# Altium project UCLA-DRS4-2.1.PrjPCB (part 2 of 10)

## Sheet ANA_FE.SchDoc: My title
size A3; Organization: University of California; Address1: 475 Portola Plaza; Address2: Los Angeles, CA 90095; DocumentNumber: 30; Revision: R01; SheetNumber: 30; SheetTotal: 35
Used 8 times, as channels DRS-Module 0/FE0, DRS-Module 0/FE2, DRS-Module 0/FE4, DRS-Module 0/FE6, DRS-Module 0/FE1, DRS-Module 0/FE3, DRS-Module 0/FE5, DRS-Module 0/FE7. Parts and nets are listed once, with the designators drawn on the sheet.
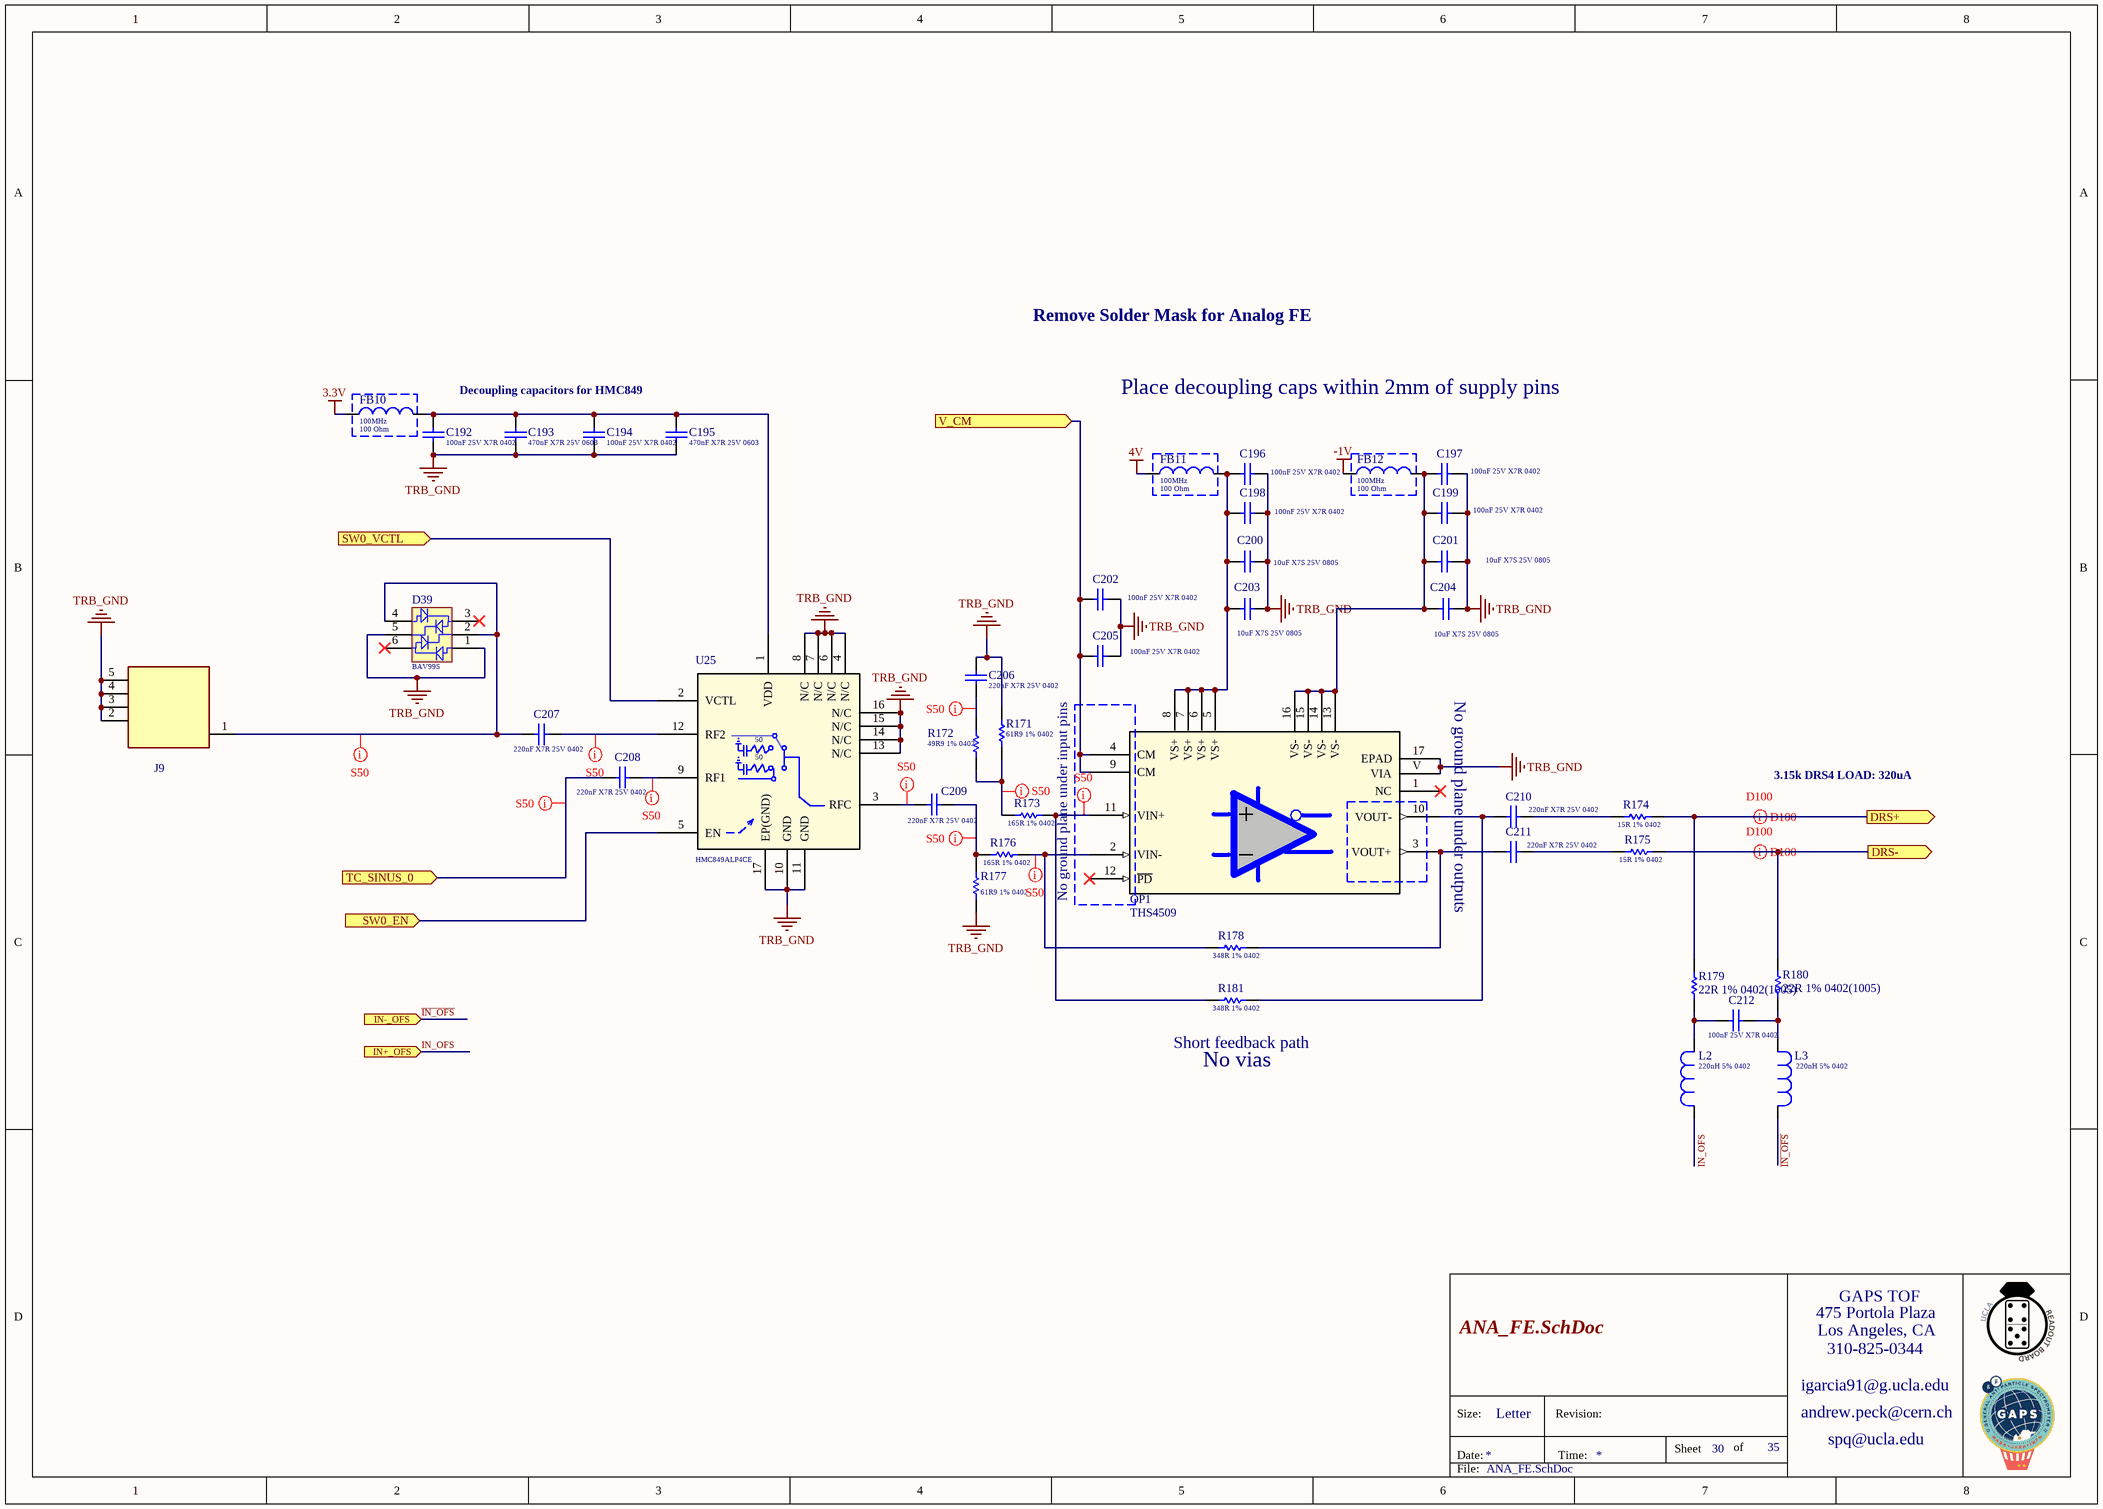
[diagram p3: ANA_FE.SchDoc]

### Parts
C192  Capacitance: 100nF 25V X7R 0402  [Cap_Taiyo_Yuden_TMK105B7104KV-FR_100nF]  (hidden comment: Cap_Taiyo_Yuden_TMK105B7104KV-FR_100nF)
C193  Capacitance: 470nF X7R 25V 0603  [Cap_Wurth_Electronics_885012206075_470nF]  (hidden comment: Cap_Wurth_Electronics_885012206075_470nF)
C194  Capacitance: 100nF 25V X7R 0402  [Cap_Taiyo_Yuden_TMK105B7104KV-FR_100nF]  (hidden comment: Cap_Taiyo_Yuden_TMK105B7104KV-FR_100nF)
C195  Capacitance: 470nF X7R 25V 0603  [Cap_Wurth_Electronics_885012206075_470nF]  (hidden comment: Cap_Wurth_Electronics_885012206075_470nF)
C196  Capacitance: 100nF 25V X7R 0402  [Cap_Taiyo_Yuden_TMK105B7104KV-FR_100nF]  (hidden comment: Cap_Taiyo_Yuden_TMK105B7104KV-FR_100nF)
C197  Capacitance: 100nF 25V X7R 0402  [Cap_Taiyo_Yuden_TMK105B7104KV-FR_100nF]  (hidden comment: Cap_Taiyo_Yuden_TMK105B7104KV-FR_100nF)
C198  Capacitance: 100nF 25V X7R 0402  [Cap_Taiyo_Yuden_TMK105B7104KV-FR_100nF]  (hidden comment: Cap_Taiyo_Yuden_TMK105B7104KV-FR_100nF)
C199  Capacitance: 100nF 25V X7R 0402  [Cap_Taiyo_Yuden_TMK105B7104KV-FR_100nF]  (hidden comment: Cap_Taiyo_Yuden_TMK105B7104KV-FR_100nF)
C200  Capacitance: 10uF X7S 25V 0805  [Cap_Murata_ GRM21BC71E106ME11L_10uF]  (hidden comment: Cap_Murata_ GRM21BC71E106ME11L_10uF)
C201  Capacitance: 10uF X7S 25V 0805  [Cap_Murata_ GRM21BC71E106ME11L_10uF]  (hidden comment: Cap_Murata_ GRM21BC71E106ME11L_10uF)
C202  Capacitance: 100nF 25V X7R 0402  [Cap_Taiyo_Yuden_TMK105B7104KV-FR_100nF]  (hidden comment: Cap_Taiyo_Yuden_TMK105B7104KV-FR_100nF)
C203  Capacitance: 10uF X7S 25V 0805  [Cap_Murata_ GRM21BC71E106ME11L_10uF]  (hidden comment: Cap_Murata_ GRM21BC71E106ME11L_10uF)
C204  Capacitance: 10uF X7S 25V 0805  [Cap_Murata_ GRM21BC71E106ME11L_10uF]  (hidden comment: Cap_Murata_ GRM21BC71E106ME11L_10uF)
C205  Capacitance: 100nF 25V X7R 0402  [Cap_Taiyo_Yuden_TMK105B7104KV-FR_100nF]  (hidden comment: Cap_Taiyo_Yuden_TMK105B7104KV-FR_100nF)
C206  Capacitance: 220nF X7R 25V 0402  [Cap_TDK_C1608X5R1A106M080AC_220nF]  (hidden comment: Cap_TDK_C1608X5R1A106M080AC_220nF)
C207  Capacitance: 220nF X7R 25V 0402  [Cap_TDK_C1608X5R1A106M080AC_220nF]  (hidden comment: Cap_TDK_C1608X5R1A106M080AC_220nF)
C208  Capacitance: 220nF X7R 25V 0402  [Cap_TDK_C1608X5R1A106M080AC_220nF]  (hidden comment: Cap_TDK_C1608X5R1A106M080AC_220nF)
C209  Capacitance: 220nF X7R 25V 0402  [Cap_TDK_C1608X5R1A106M080AC_220nF]  (hidden comment: Cap_TDK_C1608X5R1A106M080AC_220nF)
C210  Capacitance: 220nF X7R 25V 0402  [Cap_TDK_C1608X5R1A106M080AC_220nF]  (hidden comment: Cap_TDK_C1608X5R1A106M080AC_220nF)
C211  Capacitance: 220nF X7R 25V 0402  [Cap_TDK_C1608X5R1A106M080AC_220nF]  (hidden comment: Cap_TDK_C1608X5R1A106M080AC_220nF)
C212  Capacitance: 100nF 25V X7R 0402  [Cap_Taiyo_Yuden_TMK105B7104KV-FR_100nF]  (hidden comment: Cap_Taiyo_Yuden_TMK105B7104KV-FR_100nF)
D39  BAV99S  [INF-SOT363_V]
FB10  Measuring Frequency: 100MHz  Impedance: 100 Ohm  [FB_Wurth_Electronics_742792731_100Ohms]  (hidden comment: 742792731)
FB11  Measuring Frequency: 100MHz  Impedance: 100 Ohm  [FB_Wurth_Electronics_742792731_100Ohms]  (hidden comment: 742792731)
FB12  Measuring Frequency: 100MHz  Impedance: 100 Ohm  [FB_Wurth_Electronics_742792731_100Ohms]  (hidden comment: 742792731)
J9  SMA JACK 50 OHM  [Amphenol_132289_0]  (value not drawn)
L2  Inductance: 220nH 5% 0402  [Ind_TDK_ MLG1005SR22JT000_220nH]  (hidden comment: Ind_TDK_ MLG1005SR22JT000_220nH)
L3  Inductance: 220nH 5% 0402  [Ind_TDK_ MLG1005SR22JT000_220nH]  (hidden comment: Ind_TDK_ MLG1005SR22JT000_220nH)
OP1  THS4509  [RGT16]
R171  61R9 1% 0402  [RESC0402(1005)_L]
R172  49R9 1% 0402  [RESC0402(1005)_L]
R173  165R 1% 0402  [RESC0402(1005)_L]
R174  15R 1% 0402  [RESC0402(1005)_L]
R175  15R 1% 0402  [RESC0402(1005)_L]
R176  165R 1% 0402  [RESC0402(1005)_L]
R177  61R9 1% 0402  [RESC0402(1005)_L]
R178  348R 1% 0402  [RESC0402(1005)_L]
R179  22R 1% 0402(1005)  [RESC0402(1005)_N]
R180  22R 1% 0402(1005)  [RESC0402(1005)_N]
R181  348R 1% 0402  [RESC0402(1005)_L]
U25  HMC849  [CP_16_40]  (value not drawn)

### Ports
DRS+ (out), DRS- (out), IN+_OFS (in), IN-_OFS (in), SW0_EN (in), SW0_VCTL (in), TC_SINUS_0 (in), V_CM (in)

### Nets
3.3V: FB10.1
4V: FB11.1
-1V: FB12.1
TRB_GND: C192.1 C193.2 C194.1 C195.2 C196.2 C197.2 C198.2 C199.2 C200.1 C201.1 C202.2 C203.1 C204.1 C205.2 C206.1 D39.1(A1) D39.5(K5) J9.2(MNT_1) J9.3(MNT_2) J9.4(MNT_3) J9.5(MNT_4) OP1.17(EPAD) OP1.V(VIA) R171.2 R177.1 U25.4(N/C) U25.6(N/C) U25.7(N/C) U25.8(N/C) U25.10(GND) U25.11(GND) U25.13(N/C) U25.14(N/C) U25.15(N/C) U25.16(N/C) U25.17(EP(GND))
DRS+: R174.2 R179.2 ; port DRS+
DRS-: R175.2 R180.2 ; port DRS-
~{IN}~{_OFS}: L3.1 ; port IN-_OFS
IN_OFS: L2.2 ; port IN+_OFS
SW0_EN: U25.5(EN) ; port SW0_EN
SW0_VCTL: U25.2(VCTL) ; port SW0_VCTL
TC_SINUS_0: C208.2 ; port TC_SINUS_0
V_CM: C202.1 C205.1 OP1.4(CM) OP1.9(CM) ; port V_CM
NetC192_2: C192.2 C193.1 C194.2 C195.1 FB10.2 U25.1(VDD)
NetC196_1: C196.1 C198.1 C200.2 C203.2 FB11.2 OP1.5(VS+) OP1.6(VS+) OP1.7(VS+) OP1.8(VS+)
NetC197_1: C197.1 C199.1 C201.2 C204.2 FB12.2 OP1.13(VS-) OP1.14(VS-) OP1.15(VS-) OP1.16(VS-)
NetC206_2: C206.2 R172.2
NetC207_1: C207.1 U25.12(RF2)
NetC207_2: C207.2 D39.2(K2) D39.4(A4) J9.1
NetC208_1: C208.1 U25.9(RF1)
NetC209_1: C209.1 R176.1 R177.2
NetC209_2: C209.2 U25.3(RFC)
NetC210_1: C210.1 R174.1
NetC210_2: C210.2 OP1.10(VOUT-) R181.2
NetC211_1: C211.1 R175.1
NetC211_2: C211.2 OP1.3(VOUT+) R178.2
NetC212_1: C212.1 L2.1 R179.1
NetC212_2: C212.2 L3.2 R180.1
NetOP1_2: OP1.2(VIN-) R176.2 R178.1
NetOP1_11: OP1.11(VIN+) R173.2 R181.1
NetR171_1: R171.1 R172.1 R173.1

Not connected (* = marked no-connect by the designer): D39 3(C3)* 6(C6)*; OP1 1(NC)* 12(~{PD})*

### Channels
DRS-Module 0/FE0: designators end in A; ports DRS+=DRS4_IN0_P DRS-=DRS4_IN0_N IN+_OFS=IN+_OFS IN-_OFS=~{IN}~{_OFS} SW0_EN=HMC849:EN0 SW0_VCTL=HMC849:VCTL0 TC_SINUS_0=TC_0 V_CM=V_CM
DRS-Module 0/FE2: designators end in B; ports DRS+=DRS4_IN2_P DRS-=DRS4_IN2_N IN+_OFS=IN+_OFS IN-_OFS=~{IN}~{_OFS} SW0_EN=HMC849:EN2 SW0_VCTL=HMC849:VCTL2 TC_SINUS_0=TC_2 V_CM=V_CM
DRS-Module 0/FE4: designators end in C; ports DRS+=DRS4_IN4_P DRS-=DRS4_IN4_N IN+_OFS=IN+_OFS IN-_OFS=~{IN}~{_OFS} SW0_EN=HMC849:EN4 SW0_VCTL=HMC849:VCTL4 TC_SINUS_0=TC_4 V_CM=V_CM
DRS-Module 0/FE6: designators end in D; ports DRS+=DRS4_IN6_P DRS-=DRS4_IN6_N IN+_OFS=IN+_OFS IN-_OFS=~{IN}~{_OFS} SW0_EN=HMC849:EN6 SW0_VCTL=HMC849:VCTL6 TC_SINUS_0=TC_6 V_CM=V_CM
DRS-Module 0/FE1: designators end in E; ports DRS+=DRS4_IN1_P DRS-=DRS4_IN1_N IN+_OFS=IN+_OFS IN-_OFS=~{IN}~{_OFS} SW0_EN=HMC849:EN1 SW0_VCTL=HMC849:VCTL1 TC_SINUS_0=TC_1 V_CM=V_CM
DRS-Module 0/FE3: designators end in F; ports DRS+=DRS4_IN3_P DRS-=DRS4_IN3_N IN+_OFS=IN+_OFS IN-_OFS=~{IN}~{_OFS} SW0_EN=HMC849:EN3 SW0_VCTL=HMC849:VCTL3 TC_SINUS_0=TC_3 V_CM=V_CM
DRS-Module 0/FE5: designators end in G; ports DRS+=DRS4_IN5_P DRS-=DRS4_IN5_N IN+_OFS=IN+_OFS IN-_OFS=~{IN}~{_OFS} SW0_EN=HMC849:EN5 SW0_VCTL=HMC849:VCTL5 TC_SINUS_0=TC_5 V_CM=V_CM
DRS-Module 0/FE7: designators end in H; ports DRS+=DRS4_IN7_P DRS-=DRS4_IN7_N IN+_OFS=IN+_OFS IN-_OFS=~{IN}~{_OFS} SW0_EN=HMC849:EN7 SW0_VCTL=HMC849:VCTL7 TC_SINUS_0=TC_7 V_CM=V_CM

### Layout directives
net class S50: NetC206A_2, NetC207A_1, NetC207A_2, NetC208A_1, NetC209A_1, NetC209A_2, NetOP1A_2, NetOP1A_11, NetR171A_1, TC_0
differential pair; differential pair class D100: DRS4_IN0_N, DRS4_IN0_P

### Notes on the sheet
- Remove Solder Mask for Analog FE
- Decoupling capacitors for HMC849
- Place decoupling caps within 2mm of supply pins
- No ground plane under outputs
- 3.15k DRS4 LOAD: 320uA
- D100
- (near R173) No ground plane under input pins
- (near R181) Short feedback path
- (near R181) No vias
- 475 Portola Plaza
- GAPS TOF
- igarcia91@g.ucla.edu
- Los Angeles, CA
- 310-825-0344
- Size:
- Date:
- Letter
- Revision:
- Time:
- Sheet
- of
- andrew.peck@cern.ch
- spq@ucla.edu
- File:
- (in symbol HMC849ALP4CE) 50

### Library data of the parts
C192 C194 C196-C199 C202 C205 C212 = Cap_Taiyo_Yuden_TMK105B7104KV-FR_100nF: CAP CER 100nF 25V X7R 0402; Supplier 1: Mouser; Supplier Part Number 1: 963-TMK105B7104KV-FR
C193 C195 = Cap_Wurth_Electronics_885012206075_470nF: CAP CER 470nF 25V X7R 0603; Supplier 1: Mouser; Supplier Part Number 1: 710-885012206075
C200 C201 C203 C204 = Cap_Murata_ GRM21BC71E106ME11L_10uF: CAP CER 10uF 25V X7R 0805; Supplier 1: Mouser; Supplier Part Number 1: 81-GRM21BC71E106ME1L
C206-C211 = Cap_TDK_C1608X5R1A106M080AC_220nF: CAP CER 220nF 50V X7R 0402; Supplier 1: Mouser; Supplier Part Number 1: 810-C1005X7R1E224KBE
D39 = CMP-1176-00030-1: Silicon Switching Diode, SOT363, Reel, Green; Manufacturer: Infineon; VR (max): 80Â V; VBR (min): 85Â V; IF (max): 200Â mA; trr (max): 4Â ns; Green: TRUE; VF (max): 1.25Â V; Configuration: Quadruple; IR (max): 150Â nA; PackageReference: SOT363; Halogen-free: TRUE; ComponentLink3URL: http://www.infineon.com/dgdl/SOT363-Package_Overview.pdf?folderId=db3a30431936bc4b01195360bd8f3cdc&fileId=db3a30431936bc4b0119536b62bf3cf5; PartNumber: BAV99S; ComponentLink3Description: Package Specification; ComponentLink2URL: http://www.infineon.com/dgdl/bav99series.pdf?folderId=db3a30431400ef6801141b5844e103ea&fileId=db3a30431400ef6801141c1b237d042f; ComponentLink1Description: Manufacturer URL; ComponentLink2Description: Datasheet; ComponentLink1URL: http://www.infineon.com/; PackageDescription: 6-Pin Small Outline Transistor Package, 1.25 x 2 mm Body; Mounting Technology: Surface Mount
FB10-FB12 = FB_Wurth_Electronics_742792731_100Ohms: FB SMD 100 OHM 25% 1.2A 0402; DC Resistance: 90mOhm; Supplier 1: Mouser; Supplier Part Number 1: 710-742792731
J9 = Conn_Amphenol_132289_eec: CONN SMA JACK 50 OHM EDGE MNT; Part Number: 132289; helpURL: https://upverter.com/upn/revision/b04227f5d74ab481/; ComponentLink2Description: Datasheet; Temperature: -65°C to +165°C; Package: CONN_SMA_9MM52_7M92; Supplier 2: Mouser; Price: 4.87219999201; Supplier 1: Digi-Key; ComponentLink1URL: https://upverter.com/upn/revision/b04227f5d74ab481/; Supplier Part Number 2: 523-132289; Supplier Part Number 1: ACX1426-ND; Manufacturer: Amphenol; ComponentLink1Description: Upverter; ComponentLink2URL: http://www.amphenolrf.com/downloads/dl/file/id/2775/product/2917/132289_customer_drawing.pdf; RoHS: TRUE; Mouser Part Number: 523-132289; Digikey Description: CONN SMA JACK 50 OHM EDGE MNT; Digikey Part Number: ACX1426-ND; Lead Free: yes; Temperature Range Low: -65°C; Temperature Range High: +165°C
L2 L3 = Ind_TDK_ MLG1005SR22JT000_220nH: Fixed Inductors .22 UH 5%; Supplier 1: Mouser; Supplier Part Number 1: 810-MLG1005SR22JT000
OP1 = THS4509RGTT: Differential Amplifier 1 Circuit Differential 16-QFN (3x3); Vendor: Texas Instruments; Built_By: EMA_UL_Team; C: Copyright (C) 2015 Accelerated Designs. All rights reserved; Manufacturer_Part_Number: THS4509RGTT; RefDes: RefDes; Type: DEV; Value: Value; Supplier 1: Mouser; Supplier Part Number 1: 595-THS4509RGTT
R171 R177 = CMP-1011-00374-1: 61R9 0.063W 1% 0402 (1005 Metric)  SMD; Value: 61.90 Ohm; Case-EIA: 0402; Case-Metric: 1005; Tolerance: 1 %; Technology: SMT; Power: 0.063 W
R172 = CMP-1011-00363-1: as R106 on sheet DRS4; Power: 0.063 W; Technology: SMT; Tolerance: 1 %
R173 R176 = CMP-1011-00420-1: 165R 0.063W 1% 0402 (1005 Metric)  SMD; Case-EIA: 0402; Case-Metric: 1005; Value: 165.00 Ohm; Power: 0.063 W; Technology: SMT; Tolerance: 1 %
R174 R175 = CMP-1011-00302-1: 15R 0.063W 1% 0402 (1005 Metric)  SMD; Case-Metric: 1005; Case-EIA: 0402; Value: 15.00 Ohm; Tolerance: 1 %; Power: 0.063 W; Technology: SMT
R178 R181 = CMP-1011-00457-1: 348R 0.063W 1% 0402 (1005 Metric)  SMD; Case-EIA: 0402; Value: 348.00 Ohm; Case-Metric: 1005; Tolerance: 1 %; Technology: SMT; Power: 0.063 W
R179 R180 = CMP-1011-00320-1: 22R 0.063W 1% 0402 (1005 Metric)  SMD; Case-EIA: 0402; Case-Metric: 1005; Value: 22.00 Ohm; Tolerance: 1 %; Technology: SMT; Power: 0.063 W
U25 = HMC849ALP4CE: RF Switch ICs DC-6 GHZ Hi Isolation Switch; Vendor: Analog Devices Inc; Built_By: Analog Devices Imc.; Manufacturer_Part_Number: HMC849ALP4CE; RefDes: RefDes; Type: DEV; Supplier 1: Mouser; Supplier Part Number 1: 584-HMC849ALP4CE; Series: HMC849ALP4CE